# EAGLE design 280112_Battery_Connector_UEBK-30257_1.0 (EAGLE 9.6.2)
Assembly variants: B1, C
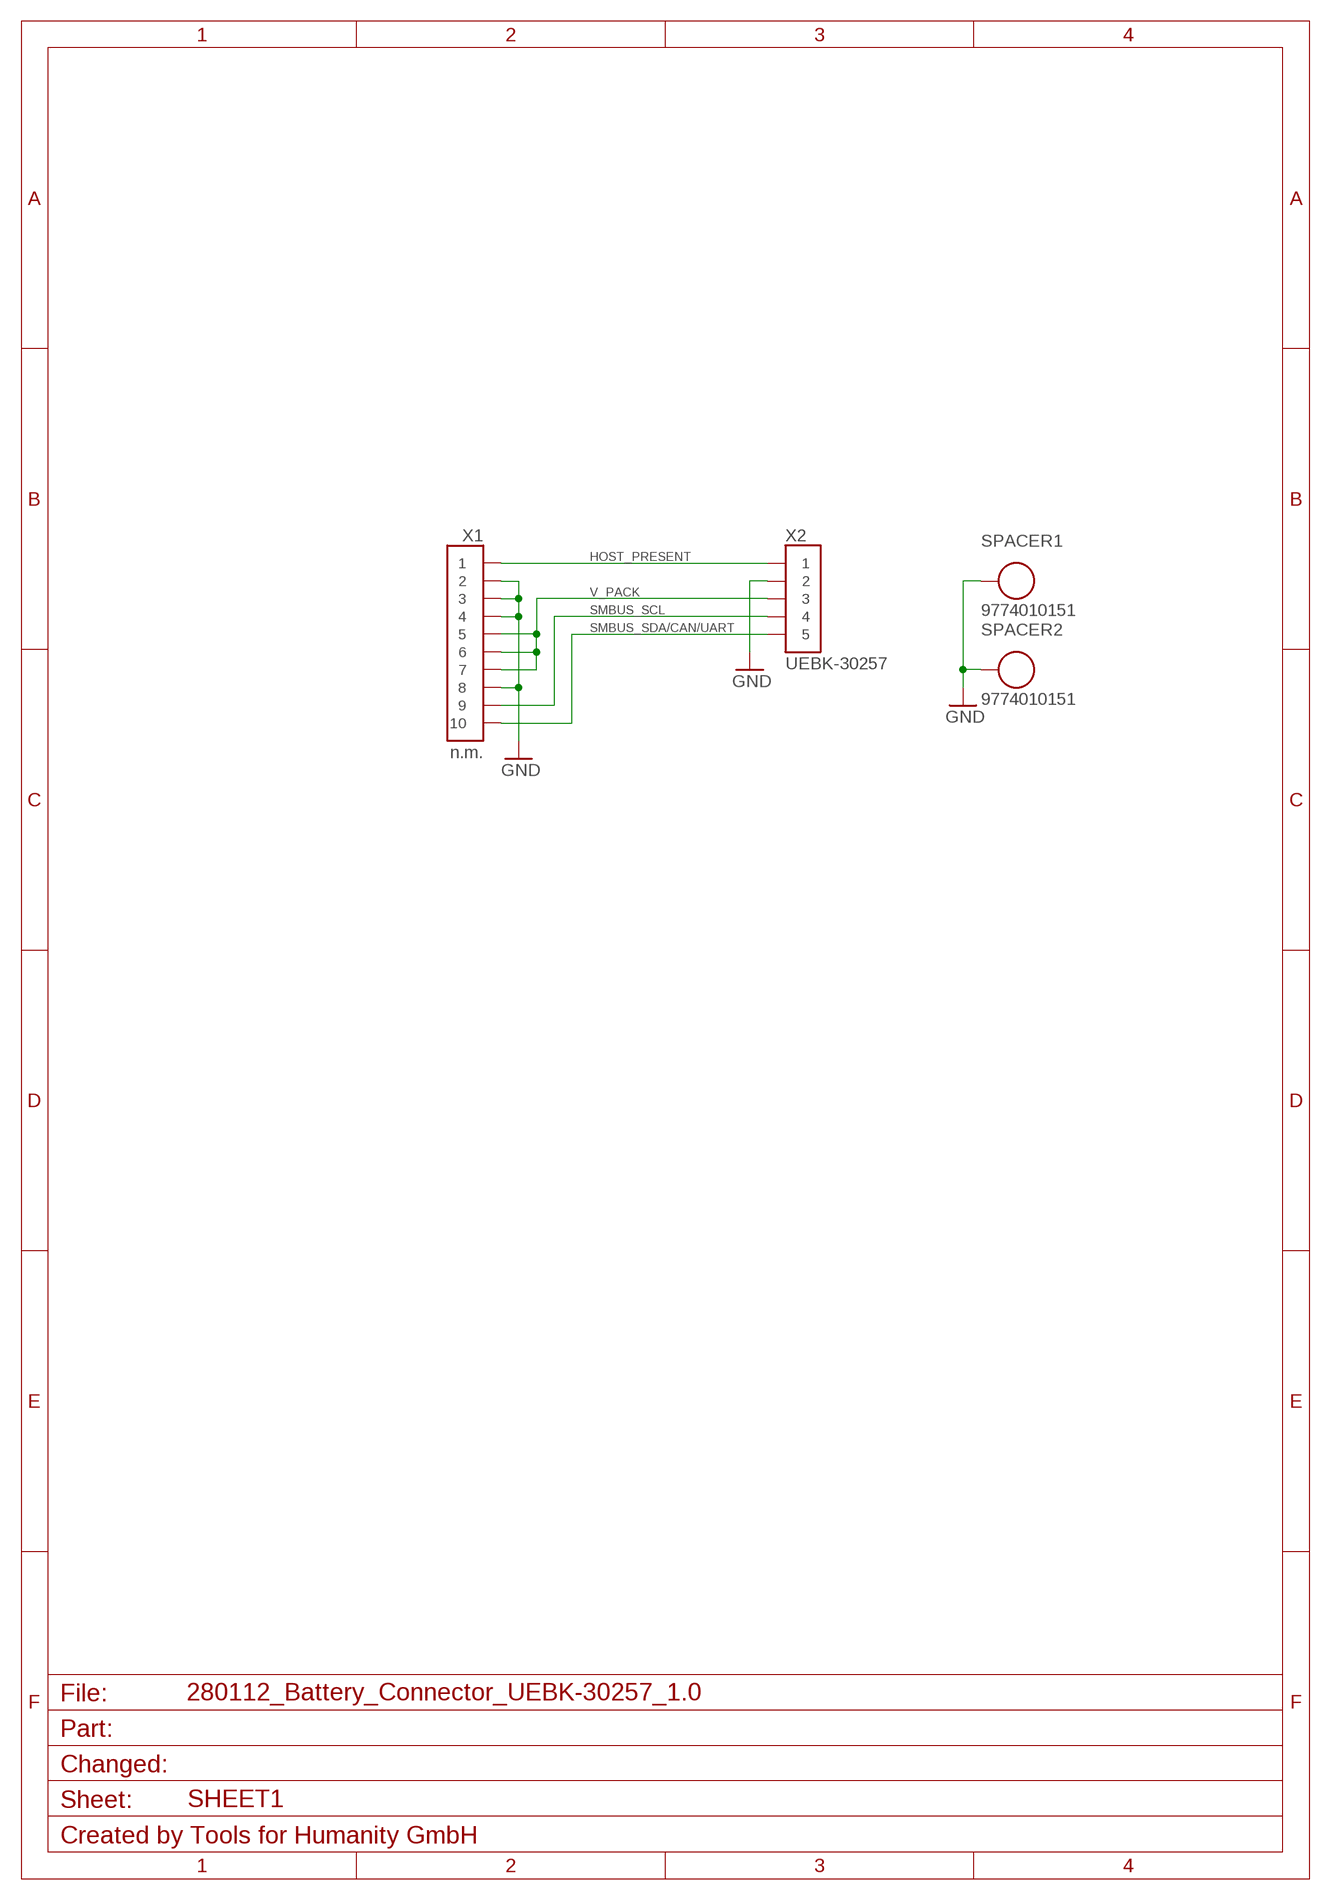
[diagram p0: schematic, sheet 1]

## Parts
SPACER1  9774010151  [WA-SMSI_9774010151_WUERTH]
SPACER2  9774010151  [WA-SMSI_9774010151_WUERTH]
X1  n.m.  61301011121  [61301011121_WUERTH]  (not fitted in variant B1)  (variant C: 61301011121)
X2  UEBK-30257  [UEBK-30257_UWE]

## Nets
GND: SPACER1.2 SPACER1.3 SPACER2.2 SPACER2.3 X1.2 X1.3 X1.4 X1.8 X2.2
HOST_PRESENT: X1.1 X2.1
SMBUS_SCL: X1.9 X2.4
SMBUS_SDA/CAN/UART: X1.10 X2.5
V_PACK: X1.5 X1.6 X1.7 X2.3

## Library data of the parts
SPACER1 SPACER2 = 00_DT_Connectors:9774010151: 9774010151, WA-SMSI SMT Steel Spacer, M2.5 Thread Internal, L = 1.0 mm; CHANGED: 2021-09-07; CREATED: 2021-09-07; MANUFACTURER: Wuerth; MAX_OP_TEMP: 150 °C; MIN_OP_TEMP: -55 °C; ROHS: yes; STATUS: active
X1 = 00_DT_Connectors:61301011121: 61301011121, WR-PHD, 2.54mm pin header, 3.0 A, THT; CHANGED: 2021-09-07; CREATED: 2021-09-07; CURRENT: 3.0 A; MANUFACTURER: Wuerth; MAX_OP_TEMP: 105 °C; MIN_OP_TEMP: -40 °C; ROHS: yes; STATUS: active; VOLTAGE: 500 V(AC)
X2 = 00_DT_Connectors:UEBK-30257: UEBK-30257, battery connector, 10.0 A; CHANGED: 2021-09-07; CREATED: 2021-09-07; CURRENT: 10.0 A; MANUFACTURER: uwe electronic GmbH; MAX_OP_TEMP: ???; MIN_OP_TEMP: ???; ROHS: yes; STATUS: active

## Board
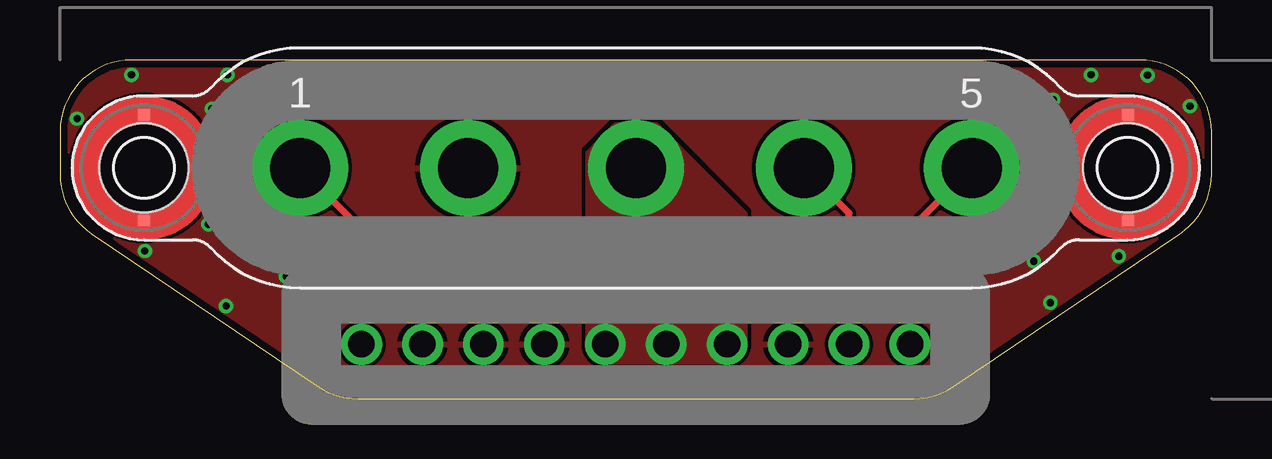
[diagram p1: board, top side]
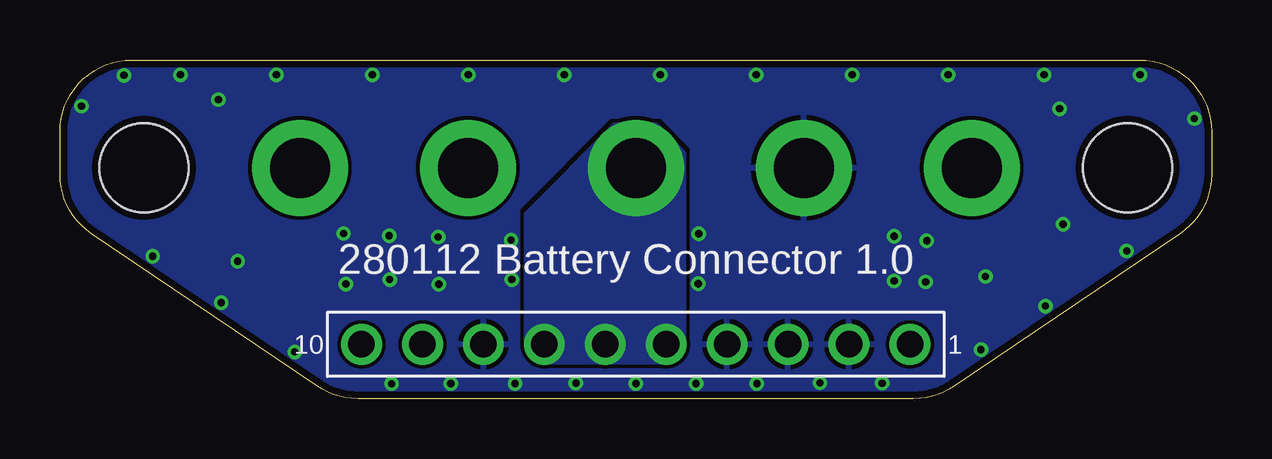
[diagram p2: board, bottom side, seen from below]

Size 48 x 14.13 mm. Coordinates in mm from the lower left corner, seen from the top.
Outline: 48,11.13 arc90 45,14.13 3,14.13 arc90 0,11.13 0,9.36 arc56 1.32,6.88 10.74,0.51 arc34 12.42,0 35.58,0 arc34 37.26,0.51 46.68,6.88 arc56 48,9.36 48,11.13
Copper layers (1*16): Top 0.035mm / dielectric 1.5mm / Bottom 0.035mm
Design rules "multi-cb_2L_035um-cu_150um_Strukturen": minimum track width 0.15mm, minimum drill 0.3mm, track to track 0.15mm, track to pad 0.15mm, pad to pad 0.15mm, via to via 0.15mm, smd to smd 0.15mm, copper to edge 0.3mm, drill to drill 0.2mm, minimum pad ring 0.2mm, minimum via ring 0.15mm, stop-mask expansion 0.05mm, vias tented up to drill 0.3mm, thermal gap 8mil

### Footprints (pad centres in the part's own frame; a part is rotated, then mirrored left to right if it is on the bottom)
WA-SMSI_9774010151_WUERTH = smd 0.5 x 0.5: 2 0,2.19; 3 0,-2.19 | hole 3.7: 0,0
61301011121_WUERTH = drill 1.1 pad 1.7: 1 -11.43,0; 2 -8.89,0; 3 -6.35,0; 4 -3.81,0; 5 -1.27,0; 6 1.27,0; 7 3.81,0; 8 6.35,0; 9 8.89,0; 10 11.43,0
UEBK-30257_UWE = drill 2.5 pad 4: 1 -14,0; 2 -7,0; 3 0,0; 4 7,0; 5 14,0

### Placement (x,y rotation side)
SPACER1  3.5,9.63 0 top
SPACER2  44.5,9.63 0 top
X1  61301011121  [61301011121_WUERTH]  24,2.27 180 bottom
X2  24,9.63 0 top

### Tracks (layer width: path | path; a pad name or v marks a point on that pad's centre or on a via)
GND  (via drill 0.3)
  other vias: 2.98,13.51 6.98,13.51 10.98,13.51 14.98,13.51 18.98,13.51 22.98,13.51 26.98,13.51 30.98,13.51 34.98,13.51 38.98,13.51 42.98,13.51 45.33,13.49 47.11,12.2 44.14,5.94 41.28,4 38.22,1.95 34.18,0.63 31.71,0.63 29.03,0.63 26.49,0.65 24,0.63 21.49,0.63 18.95,0.63 16.32,0.66 13.73,0.64 9.61,2.05 6.92,3.86 3.54,6.16 0.72,11.68 11.87,6.59 13.23,6.78 21.39,4.79 21.38,6.88 29.2,6.62 29.17,4.97 34.25,4.97 34.28,6.79 36.18,6.89 36.08,4.78 40.59,5.73 41.4,12.48 6.33,12.1 6.19,7.28 9.42,5.1 13.23,4.91 11.92,4.87 32.24,6.75 32.21,4.77
  pour Top (rank 6): 0.15,13.98 47.85,13.98 47.85,0.18 0.15,0.18
  pour Top (no thermals): 0.15,13.98 6.9,13.98 6.9,6.03 0.15,6.03
  pour Top (no thermals): 41.1,13.98 47.85,13.98 47.85,6.03 41.1,6.03
  pour Bottom (rank 6): 0.15,13.98 47.85,13.98 47.85,0.18 0.15,0.18
HOST_PRESENT
  Top 0.3: X1.1 12.57,7.06 X2.1
SMBUS_SCL
  Top 0.3: X1.9 32.89,7.74 X2.4
SMBUS_SDA/CAN/UART
  Top 0.3: X1.10 35.43,7.06 X2.5
V_PACK
  pour Top (no thermals): 21.97,2.24 22.71,1.5 27.82,1.5 28.59,2.28 28.59,7.73 24.88,11.45 23.14,11.45 21.97,10.27
  pour Bottom (no thermals): 21.97,2.24 22.71,1.5 27.82,1.5 28.59,2.28 28.59,7.73 24.88,11.45 23.14,11.45 21.97,10.27

### Text on the board
bPlace: 280112 Battery Connector 1.0